# EAGLE design dwm1000_ff3_brd (EAGLE 6.4)
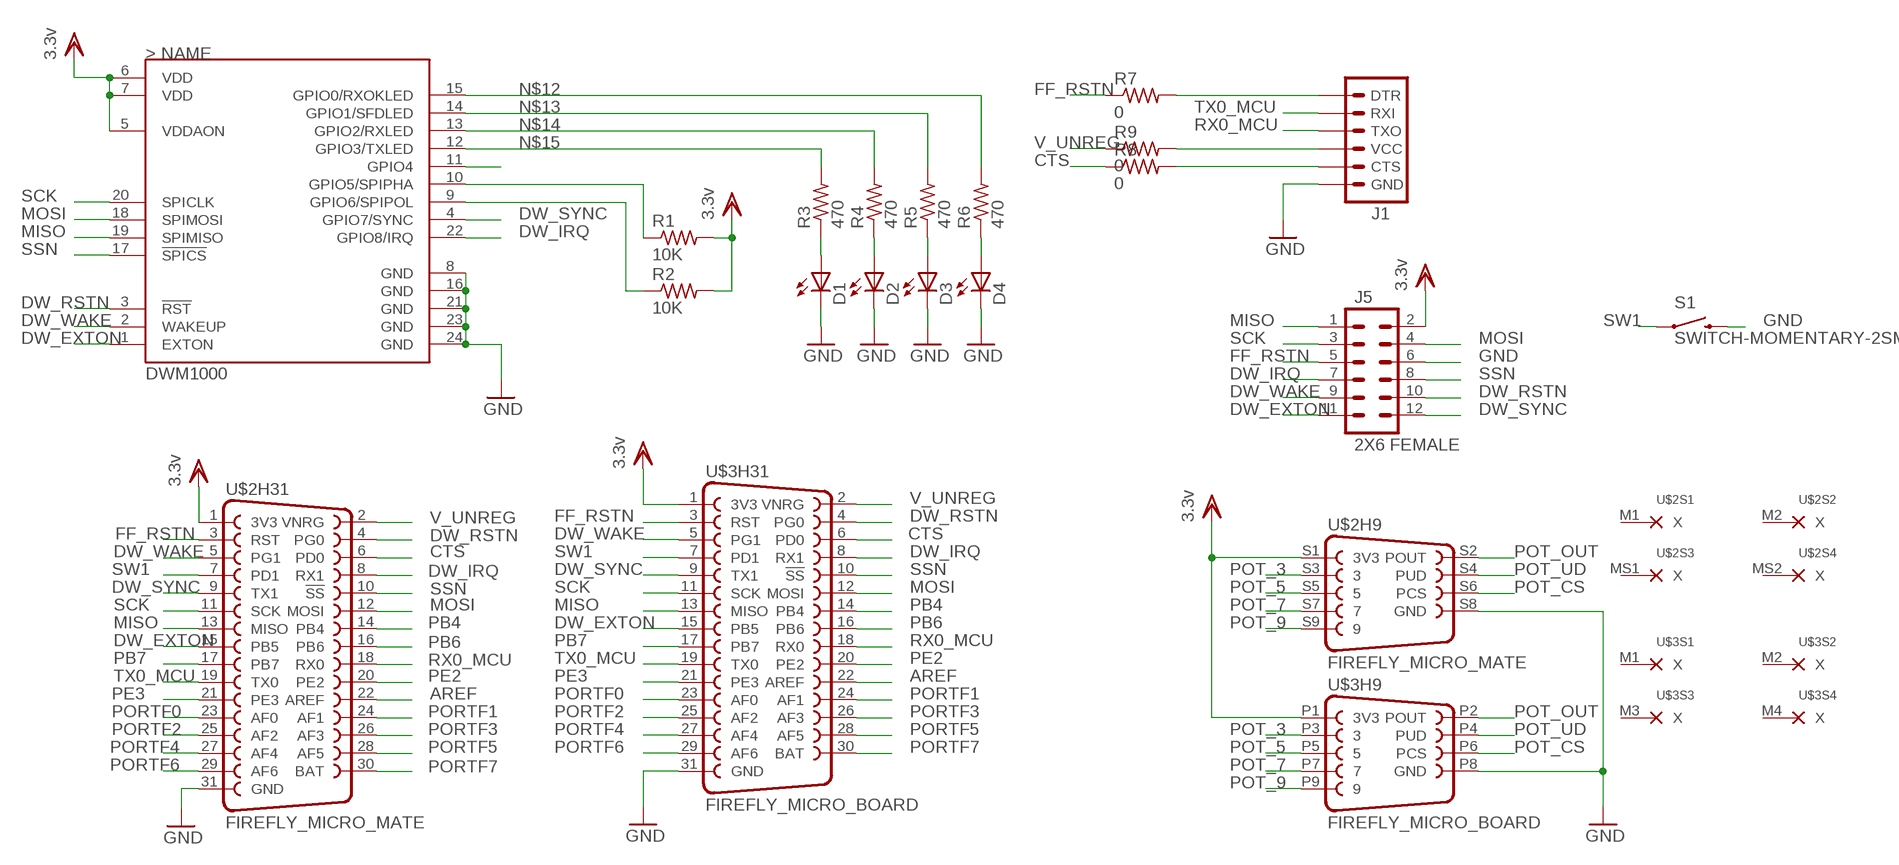
[diagram p0: schematic, sheet 1]

## Parts
D1  LEDCHIP-LED0603  [CHIP-LED0603]
D2  LEDCHIP-LED0603  [CHIP-LED0603]
D3  LEDCHIP-LED0603  [CHIP-LED0603]
D4  LEDCHIP-LED0603  [CHIP-LED0603]
J1  ARDUINO_SERIAL_PROGRAMPTH  [1X06]
J5  2X6 FEMALE  M06X2PTH_FEMALE  [2X6]
R1  10K  R-US_R0603  [R0603]
R2  10K  R-US_R0603  [R0603]
R3  470  R-US_R0603  [R0603]
R4  470  R-US_R0603  [R0603]
R5  470  R-US_R0603  [R0603]
R6  470  R-US_R0603  [R0603]
R7  0  R-US_R0603  [R0603]
R8  0  R-US_R0603  [R0603]
R9  0  R-US_R0603  [R0603]
S1  SWITCH-MOMENTARY-2SMD  [TACTILE-SWITCH-SMD]
U$1  DWM1000  [DWM1000]
U$2  FIREFLY_MICRO_MATE  [FIREFLY_MICRO_MATE]
U$3  FIREFLY_MICRO_BOARD  [FIREFLY_MICRO_BOARD]

## Nets
AREF: U$2.22(H31:AREF) U$3.22(H31:AREF)
CTS: R8.1 U$2.6(H31:PD0) U$3.6(H31:PD0)
DW_EXTON: J5.11 U$1.1(EXTON) U$2.15(H31:PB5) U$3.15(H31:PB5)
DW_IRQ: J5.7 U$1.22(GPIO8/IRQ) U$2.8(H31:RX1) U$3.8(H31:RX1)
DW_RSTN: J5.10 U$1.3(!RST) U$2.4(H31:PG0) U$3.4(H31:PG0)
DW_SYNC: J5.12 U$1.4(GPIO7/SYNC) U$2.9(H31:TX1) U$3.9(H31:TX1)
DW_WAKE: J5.9 U$1.2(WAKEUP) U$2.5(H31:PG1) U$3.5(H31:PG1)
FF_RSTN: J5.5 R7.1 U$2.3(H31:RST) U$3.3(H31:RST)
GND: D1.C D2.C D3.C D4.C J1.6(GND) J5.6 S1.3 U$1.8(GND) U$1.16(GND) U$1.21(GND) U$1.23(GND) U$1.24(GND) U$2.31(H31:GND) U$2.S8(H9:GND) U$3.31(H31:GND) U$3.P8(H9:GND)
MISO: J5.1 U$1.19(SPIMISO) U$2.13(H31:MISO) U$3.13(H31:MISO)
MOSI: J5.4 U$1.18(SPIMOSI) U$2.12(H31:MOSI) U$3.12(H31:MOSI)
N$1: D1.A R3.1
N$2: R1.1 U$1.10(GPIO5/SPIPHA)
N$3: D2.A R4.1
N$4: D3.A R5.1
N$5: D4.A R6.1
N$6: J1.4(VCC) R9.2
N$8: R2.1 U$1.9(GPIO6/SPIPOL)
N$12: R6.2 U$1.15(GPIO0/RXOKLED)
N$13: R5.2 U$1.14(GPIO1/SFDLED)
N$14: R4.2 U$1.13(GPIO2/RXLED)
N$15: R3.2 U$1.12(GPIO3/TXLED)
N$16: U$1.11(GPIO4)
N$18: J1.1(DTR) R7.2
N$19: J1.5(CTS) R8.2
PB4: U$2.14(H31:PB4) U$3.14(H31:PB4)
PB6: U$2.16(H31:PB6) U$3.16(H31:PB6)
PB7: U$2.17(H31:PB7) U$3.17(H31:PB7)
PE2: U$2.20(H31:PE2) U$3.20(H31:PE2)
PE3: U$2.21(H31:PE3) U$3.21(H31:PE3)
PORTF0: U$2.23(H31:AF0) U$3.23(H31:AF0)
PORTF1: U$2.24(H31:AF1) U$3.24(H31:AF1)
PORTF2: U$2.25(H31:AF2) U$3.25(H31:AF2)
PORTF3: U$2.26(H31:AF3) U$3.26(H31:AF3)
PORTF4: U$2.27(H31:AF4) U$3.27(H31:AF4)
PORTF5: U$2.28(H31:AF5) U$3.28(H31:AF5)
PORTF6: U$2.29(H31:AF6) U$3.29(H31:AF6)
PORTF7: U$2.30(H31:BAT) U$3.30(H31:BAT)
POT_3: U$2.S3 U$3.P3
POT_5: U$2.S5 U$3.P5
POT_7: U$2.S7 U$3.P7
POT_9: U$2.S9 U$3.P9
POT_CS: U$2.S6(H9:PCS) U$3.P6(H9:PCS)
POT_OUT: U$2.S2(H9:POUT) U$3.P2(H9:POUT)
POT_UD: U$2.S4(H9:PUD) U$3.P4(H9:PUD)
RX0_MCU: J1.3(TXO) U$2.18(H31:RX0) U$3.18(H31:RX0)
SCK: J5.3 U$1.20(SPICLK) U$2.11(H31:SCK) U$3.11(H31:SCK)
SSN: J5.8 U$1.17(!SPICS) U$2.10(H31:!SS) U$3.10(H31:!SS)
SW1: S1.1 U$2.7(H31:PD1) U$3.7(H31:PD1)
TX0_MCU: J1.2(RXI) U$2.19(H31:TX0) U$3.19(H31:TX0)
V_UNREG: R9.1 U$2.2(H31:VNRG) U$3.2(H31:VNRG)
VDD: J5.2 R1.2 R2.2 U$1.5(VDDAON) U$1.6(VDD) U$1.7(VDD) U$2.1(H31:3V3) U$2.S1(H9:3V3) U$3.1(H31:3V3) U$3.P1(H9:3V3) ; supply symbol labelled 3.3v
Unconnected: U$2.M1(S1:X) U$2.M2(S2:X) U$2.MS1(S3:X) U$2.MS2(S4:X) U$3.M1(S1:X) U$3.M2(S2:X) U$3.M3(S3:X) U$3.M4(S4:X)

## Library data of the parts
D1-D4 = led:LED: LED OSRAM: - CHIPLED LG R971, LG N971, LY N971, LG Q971, LY Q971, LO R971, LY R971 LH N974, LH R974 LS Q976, LO Q976, LY Q976 LO Q996 - Hyper CHIPLED LW Q18S LB Q993, LB Q99A, LB R99A - SideLED LS A670, LO A670, LY A670, LG A670, LP A670 LB A673, LV A673, LT A673, LW A673 LH A674 LY A675 LS A676, LA A676, LO A676, LY A676, LW A676 LS A679, LY A679, LG A679 - Hyper Micro SIDELED® LS Y876, LA Y876, LO Y876, LY Y876 LT Y87S - SmartLED LW L88C, LW L88S LB L89C, LB L89S, LG L890 LS L89K, LO L89K, LY L89K LS L896, LA L896, LO L896, LY L896 - TOPLED LS T670, LO T670, LY T670, LG T670, LP T670 LSG T670, LSP T670, LSY T670, LOP T670, LYG T670 LG T671, LOG T671, LSG T671 LB T673, LV T673, LT T673, LW T673 LH T674 LS T676, LA T676, LO T676, LY T676, LB T676, LH T676, LSB T676, LW T676 LB T67C, LV T67C, LT T67C, LS T67K, LO T67K, LY T67K, LW E67C LS E67B, LA E67B, LO E67B, LY E67B, LB E67C, LV E67C, LT E67C LW T67C LS T679, LY T679, LG T679 LS T770, LO T770, LY T770, LG T770, LP T770 LB T773, LV T773, LT T773, LW T773 LH T774 LS E675, LA E675, LY E675, LS T675 LS T776, LA T776, LO T776, LY T776, LB T776 LHGB T686 LT T68C, LB T68C - Hyper Mini TOPLED® LB M676 - Mini TOPLED Santana® LG M470 LS M47K, LO M47K, LY M47K Source: http://www.osram.convergy.de LUXEON: - LUMILED® LXK2-PW12-R00, LXK2-PW12-S00, LXK2-PW14-U00, LXK2-PW14-V00 LXK2-PM12-R00, LXK2-PM12-S00, LXK2-PM14-U00 LXK2-PE12-Q00, LXK2-PE12-R00, LXK2-PE12-S00, LXK2-PE14-T00, LXK2-PE14-U00 LXK2-PB12-K00, LXK2-PB12-L00, LXK2-PB12-M00, LXK2-PB14-N00, LXK2-PB14-P00, LXK2-PB14-Q00 LXK2-PR12-L00, LXK2-PR12-M00, LXK2-PR14-Q00, LXK2-PR14-R00 LXK2-PD12-Q00, LXK2-PD12-R00, LXK2-PD12-S00 LXK2-PH12-R00, LXK2-PH12-S00 LXK2-PL12-P00, LXK2-PL12-Q00, LXK2-PL12-R00 Source: www.luxeon.com KINGBRIGHT: KA-3528ASYC Source: www.kingbright.com
J1 = SparkFun-Connectors:ARDUINO_SERIAL_PROGRAM: FTDI connector footprints
J5 = SparkFun-Connectors:M06X2; PROD_ID: CONN-12423
R1-R9 = rcl:R-US_: RESISTOR, American symbol
S1 = SparkFun-Electromechanical:SWITCH-MOMENTARY-2: Various NO switches- pushbuttons, reed, etc; PROD_ID: SWCH-08247
U$1 = Decawave:DWM1000: Decawave Module DWM1000 DecaWave module with on-board chip antenna
U$2 = Boards:FIREFLY: Addon Board for Firefly Sensor Nodes This version is compliant with Firefly Micro powered by Atmel Atmega128RFA1. Connectors on female gender match those on Firefly Micro Board. Connectors on male gender mate with Firefly Micro Board. Use these for addons.; GENDER: Male
U$3 = Boards:FIREFLY: Addon Board for Firefly Sensor Nodes This version is compliant with Firefly Micro powered by Atmel Atmega128RFA1. Connectors on female gender match those on Firefly Micro Board. Connectors on male gender mate with Firefly Micro Board. Use these for addons.; GENDER: Female

## Board
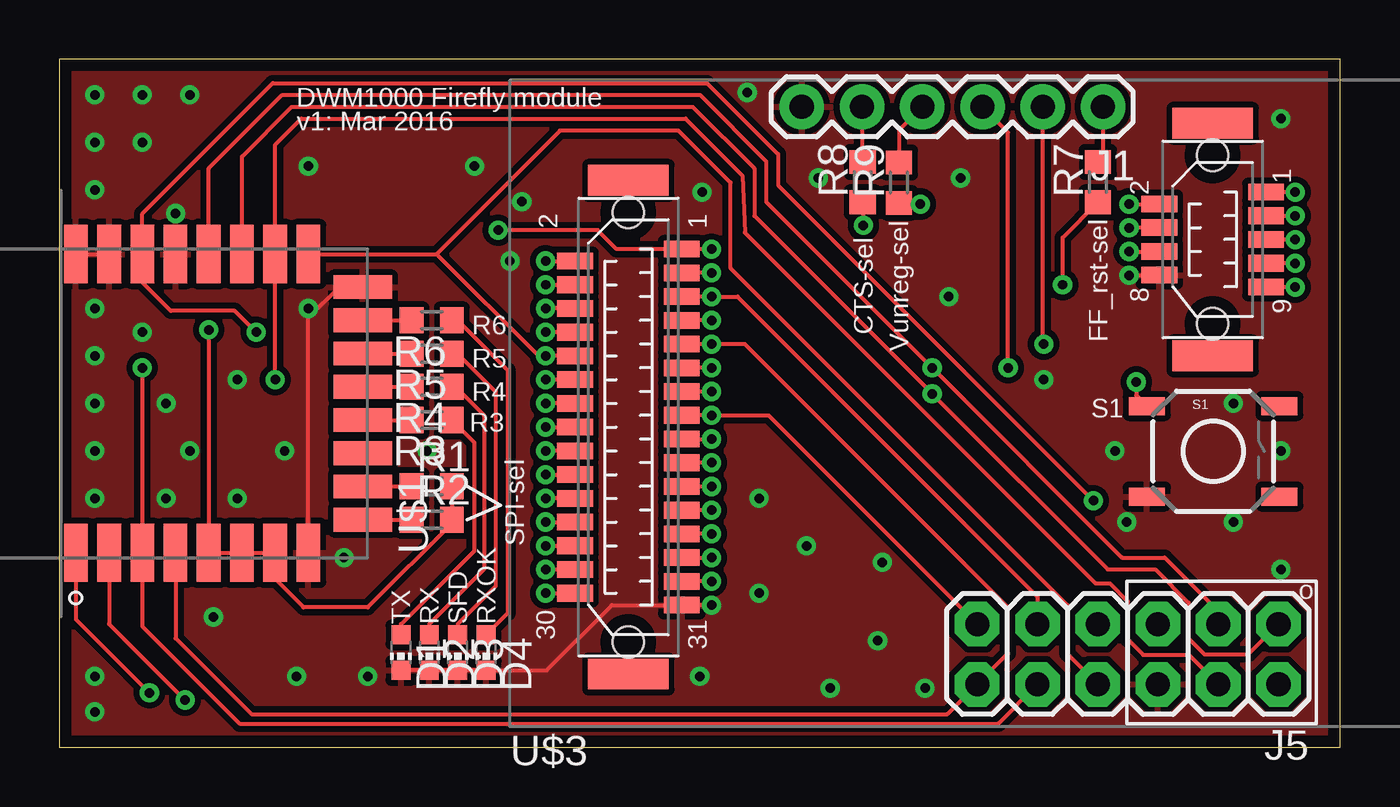
[diagram p1: board, top side]
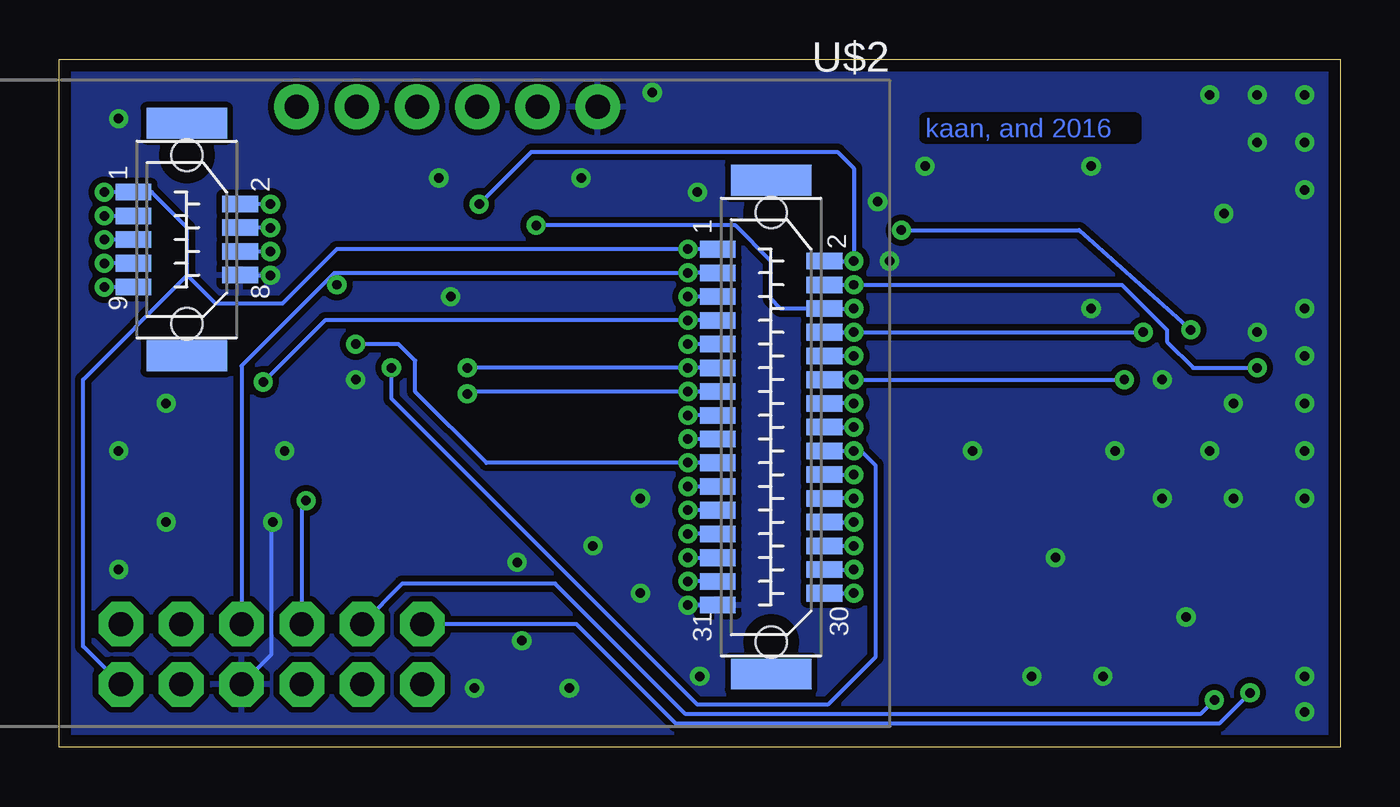
[diagram p2: board, bottom side, seen from below]

Size 54 x 29 mm. Coordinates in mm from the lower left corner, seen from the top.
Outline: 0,0 54,0 54,29 0,29 0,0
Copper layers (1*16): Top 0.035mm / dielectric 1.5mm / Bottom 0.035mm
Design rules "default *": minimum track width 7mil, minimum drill 0.4mm, track to track 7mil, track to pad 7mil, pad to pad 7mil, via to via 7mil, smd to smd 7mil, copper to edge 20mil, drill to drill 7mil, minimum pad ring 10mil, minimum via ring 8mil, stop-mask expansion 4mil, vias tented up to drill 0mil, thermal gap 10mil

### Footprints (pad centres in the part's own frame; a part is rotated, then mirrored left to right if it is on the bottom)
CHIP-LED0603 = smd 0.8 x 0.8: A 0,-0.75; C 0,0.75
1X06 = drill 1.016 pad 1.88: 1 0,0; 2 2.54,0; 3 5.08,0; 4 7.62,0; 5 10.16,0; 6 12.7,0
2X6 = drill 1.016 pad 1.88 octagon: 1 0,0; 2 0,2.54; 3 2.54,0; 4 2.54,2.54; 5 5.08,0; 6 5.08,2.54; 7 7.62,0; 8 7.62,2.54; 9 10.16,0; 10 10.16,2.54; 11 12.7,0; 12 12.7,2.54
R0603 = smd 1 x 1.1: 1 -0.85,0; 2 0.85,0
TACTILE-SWITCH-SMD = smd 1.524 x 0.762: 1 -2.794,1.905; 2 2.794,1.905; 3 -2.794,-1.905; 4 2.794,-1.905
DWM1000 = smd 2.45 x 1: 1 -6.295,12.3; 2 -6.295,10.9; 3 -6.295,9.5; 4 -6.295,8.1; 5 -6.295,6.7; 6 -6.295,5.3; 7 -6.295,3.9; 8 -6.292,2.5; 17 6.295,2.5; 18 6.295,3.9; 19 6.295,5.3; 20 6.295,6.7; 21 6.295,8.1; 22 6.295,9.5; 23 6.295,10.9; 24 6.295,12.3 | smd 1 x 2.45: 9 -4.9,0.205; 10 -3.5,0.205; 11 -2.1,0.205; 12 -0.7,0.205; 13 0.7,0.205; 14 2.1,0.205; 15 3.5,0.205; 16 4.9,0.205
FIREFLY_MICRO_MATE = smd 1.5 x 0.7: 1 -13.758,-6.497; 2 -18.258,-5.997; 3 -13.758,-5.497; 4 -18.258,-4.997; 5 -13.758,-4.497; 6 -18.258,-3.997; 7 -13.758,-3.497; 8 -18.258,-2.997; 9 -13.758,-2.497; 10 -18.258,-1.997; 11 -13.758,-1.497; 12 -18.258,-0.997; 13 -13.758,-0.497; 14 -18.258,0.003; 15 -13.758,0.503; 16 -18.258,1.003; 17 -13.758,1.503; 18 -18.258,2.003; 19 -13.758,2.503; 20 -18.258,3.003; 21 -13.758,3.503; 22 -18.258,4.003; 23 -13.758,4.503; 24 -18.258,5.003; 25 -13.758,5.503; 26 -18.258,6.003; 27 -13.758,6.503; 28 -18.258,7.003; 29 -13.758,7.503; 30 -18.258,8.003; 31 -13.758,8.503; S1 10.874,-8.905; S2 6.374,-8.405; S3 10.874,-7.905; S4 6.374,-7.405; S5 10.874,-6.905; S6 6.374,-6.405; S7 10.874,-5.905; S8 6.374,-5.405; S9 10.874,-4.905 | smd 3.4 x 1.3: M1 -16.008,-9.397; M2 -16.008,11.403; MS1 8.624,-11.805; MS2 8.624,-2.005 | hole 1.321: -16.008,-8.047; -16.008,10.053; 8.624,-10.455; 8.624,-3.355
FIREFLY_MICRO_BOARD = smd 1.5 x 0.7: 1 -13.758,6.499; 2 -18.258,5.999; 3 -13.758,5.499; 4 -18.258,4.999; 5 -13.758,4.499; 6 -18.258,3.999; 7 -13.758,3.499; 8 -18.258,2.999; 9 -13.758,2.499; 10 -18.258,1.999; 11 -13.758,1.499; 12 -18.258,0.999; 13 -13.758,0.499; 14 -18.258,-0.001; 15 -13.758,-0.501; 16 -18.258,-1.001; 17 -13.758,-1.501; 18 -18.258,-2.001; 19 -13.758,-2.501; 20 -18.258,-3.001; 21 -13.758,-3.501; 22 -18.258,-4.001; 23 -13.758,-4.501; 24 -18.258,-5.001; 25 -13.758,-5.501; 26 -18.258,-6.001; 27 -13.758,-6.501; 28 -18.258,-7.001; 29 -13.758,-7.501; 30 -18.258,-8.001; 31 -13.758,-8.501; P1 10.874,8.907; P2 6.374,8.407; P3 10.874,7.907; P4 6.374,7.407; P5 10.874,6.907; P6 6.374,6.407; P7 10.874,5.907; P8 6.374,5.407; P9 10.874,4.907 | smd 3.4 x 1.3: M1 8.624,11.807; M2 8.624,2.007; M3 -16.008,-11.401; M4 -16.008,9.399 | hole 1.321: -16.008,-10.051; -16.008,8.049; 8.624,3.357; 8.624,10.457

### Placement (x,y rotation side)
D1  14.4,4 180 top
D2  15.6,4 180 top
D3  16.8,4 180 top
D4  18,4 180 top
J1  44,27 180 top
J5  51.4,5.2 180 top
R1  15.7,11 0 top
R2  15.7,9.6 0 top
R3  15.7,13.8 180 top
R4  15.7,15.2 180 top
R5  15.7,16.6 180 top
R6  15.7,18 180 top
R7  43.78,23.82 90 top
R8  33.87,23.82 90 top
R9  35.4,23.8 90 top
S1  48.65,12.48 0 top
U$1  13,14.5 90 top
U$2  40,14.5 180 bottom
U$3  40,14.5 0 top

### Tracks (layer width: path | path; a pad name or v marks a point on that pad's centre or on a via)
AREF  (via drill 0.4)
  Top 0.178: U$3.22 v20.5,10.5
  Bottom 0.178: v20.5,10.5 U$3.22
CTS  (via drill 0.4)
  Top 0.178: U$3.6 v20.5,18.5 | v33.9,22 33.9,22.94 R8.1
  Bottom 0.178: v20.5,18.5 U$3.6 23.6,18.5 24,18.9 24,20.5 25.5,22 v33.9,22
DW_EXTON  (via drill 0.4)
  Top 0.178: v27.5,14 U$3.15 | U$1.1 0.7,5.4 v3.8,2.3 | v27.5,14 29.9,14 J5.11
  Bottom 0.178: U$3.15 v27.5,14 | v3.8,2.3 5.1,1 28,1 32.2,5.2 J5.11
DW_IRQ  (via drill 0.4)
  Top 0.178: U$3.8 v20.5,17.5 | v43.6,10.4 30.3,23.7 30.3,25 27.3,28 9,28 3.5,22.5 U$1.22 3.5,19.6 4.7,18.4 7.4,18.4 v8.3,17.5
  Bottom 0.178: U$3.8 v20.5,17.5 v8.3,17.5 | v43.6,10.4 43.78,10.22 J5.7
DW_RSTN  (via drill 0.4)
  Top 0.178: v20.5,19.5 U$3.4 | J5.10 39.58,1 7.6,1 3.5,5.1 U$1.3 v3.5,16
  Bottom 0.178: U$3.4 v20.5,19.5 | v20.5,19.5 | v20.5,19.5 9.2,19.5 7.3,17.6 7.3,17.1 6.2,16 v3.5,16
DW_SYNC  (via drill 0.4)
  Top 0.178: U$3.9 v27.5,17 28.9,17 40,5.9 40,3.96 J5.12 37.44,1.4 8.1,1.4 4.9,4.6 U$1.4
  Bottom 0.178: U$3.9 v27.5,17
DW_WAKE  (via drill 0.4)
  Top 0.178: U$3.5 v27.5,19 28.6,19 41.24,6.36 J5.9 | U$1.2 2.1,5.2 v5.3,2
  Bottom 0.178: U$3.5 v27.5,19 | J5.9 39.54,6.9 33.1,6.9 27.6,1.4 5.9,1.4 v5.3,2
FF_RSTN  (via drill 0.4)
  Top 0.178: v27.5,20 U$3.3 | v42.3,19.5 42.3,21.49 R7.1
  Bottom 0.178: U$3.3 v27.5,20 42.4,20 | 42.4,20 46.32,16.08 J5.5 | 42.4,20 42.4,19.6 v42.3,19.5
GND  (via drill 0.4)
  Top 0.178: v27.5,6 U$3.31 23.3,6 20.55,3.25 D4.C D3.C D2.C D1.C | v45.1,19.9 U$2.S8 U$3.P8 | U$1.24 U$1.23 | U$1.8 10.5,18.1 11.8,19.4 U$1.16
  Bottom 0.178: U$3.31 v27.5,6 | U$3.P8 v45.1,19.91 v45.1,19.9 | J5.6 45.05,3.93 45.05,9.45 v45,9.5
  other vias: 1.5,27.5 3.5,27.5 5.5,27.5 1.5,25.5 3.5,25.5 1.5,23.5 4.9,22.5 10.5,24.5 17.5,24.5 19.5,23 19,20.5 15.5,12.5 12,8 6.5,5.5 10,3 13,3 1.5,18.5 1.5,16.5 1.5,14.5 1.5,12.5 1.5,10.5 4.5,14.5 5.5,12.5 4.5,10.5 7.5,15.5 7.5,10.5 9.5,12.5 1.5,3 1.5,1.5 29,27.6 27.1,23.4 32,24 38,24 29.5,10.5 31.5,8.5 29.5,6.5 27,3 32.5,2.5 34.5,4.5 36.5,2.5 34.7,7.8 49.5,9.5 51.5,7.5 44.5,12.5 49.5,14.5 51.5,12.5 41.5,15.5 37.5,19 51.5,26.5 3.5,17.5 10.5,18.5
  pour Top (isolate 0.254): 0,29 54,29 54,0 0,0
  pour Bottom (isolate 0.254): 0,29 54,29 54,0 0,0
MISO  (via drill 0.4)
  Top 0.178: v27.5,15 U$3.13 | U$1.19 7.7,24.9 9.8,27 26.7,27 29.3,24.4 29.3,22.4 v36.8,14.9 36.85,14.85 44.2,7.5 46.2,7.5 47.6,6.1 47.6,4.6 48.27,3.92 50.12,3.92 J5.1
  Bottom 0.178: U$3.13 v27.5,15 36.7,15 v36.8,14.9
MOSI  (via drill 0.4)
  Top 0.178: J5.4 47.62,3.9 45.7,3.9 45.05,4.55 45.05,6.15 44.3,6.9 43.7,6.9 28.9,21.7 28.8,24.1 26.4,26.5 10.2,26.5 9.1,25.4 U$1.18 v9.1,15.5 | U$3.12 v20.5,15.5
  Bottom 0.178: U$3.12 v20.5,15.5 v9.1,15.5
N$1
  Top 0.178: R3.1 17.5,12.85 17.5,8.3 14.4,5.2 D1.A
N$2
  Top 0.178: U$1.10 R1.1
N$3
  Top 0.178: D2.A 15.6,5.2 17.9,7.5 17.9,14 16.7,15.2 R4.1
N$4
  Top 0.178: D3.A 16.8,5.2 18.4,6.8 18.4,15 16.8,16.6 R5.1
N$5
  Top 0.178: D4.A 18.9,5.65 18.9,15.9 16.8,18 R6.1
N$6
  Top 0.178: J1.4 35.4,26.02 R9.2
N$8
  Top 0.178: U$1.9 R2.1
N$12
  Top 0.178: U$1.15 R6.2
N$13
  Top 0.178: U$1.14 R5.2
N$14
  Top 0.178: U$1.13 R4.2
N$15
  Top 0.178: U$1.12 R3.2
N$18
  Top 0.178: J1.1 44,24.89 R7.2
N$19
  Top 0.178: J1.5 33.84,24.7 R8.2
PB4  (via drill 0.4)
  Top 0.178: U$3.14 v20.5,14.5
  Bottom 0.178: v20.5,14.5 U$3.14
PB6  (via drill 0.4)
  Top 0.178: v20.5,13.5 U$3.16
  Bottom 0.178: U$3.16 v20.5,13.5
PB7  (via drill 0.4)
  Top 0.178: U$3.17 v27.5,13
  Bottom 0.178: v27.5,13 U$3.17
PE2  (via drill 0.4)
  Top 0.178: v20.5,11.5 U$3.20
  Bottom 0.178: U$3.20 v20.5,11.5
PE3  (via drill 0.4)
  Top 0.178: U$3.21 v27.5,11
  Bottom 0.178: v27.5,11 U$3.21
PORTF0  (via drill 0.4)
  Top 0.178: v27.5,10 U$3.23
  Bottom 0.178: U$3.23 v27.5,10
PORTF1  (via drill 0.4)
  Top 0.178: v20.5,9.5 U$3.24
  Bottom 0.178: U$3.24 v20.5,9.5
PORTF2  (via drill 0.4)
  Top 0.178: v27.5,9 U$3.25
  Bottom 0.178: U$3.25 v27.5,9
PORTF3  (via drill 0.4)
  Top 0.178: v20.5,8.5 U$3.26
  Bottom 0.178: U$3.26 v20.5,8.5
PORTF4  (via drill 0.4)
  Top 0.178: U$3.27 v27.5,8
  Bottom 0.178: v27.5,8 U$3.27
PORTF5  (via drill 0.4)
  Top 0.178: v20.5,7.5 U$3.28
  Bottom 0.178: U$3.28 v20.5,7.5
PORTF6  (via drill 0.4)
  Top 0.178: v27.5,7 U$3.29
  Bottom 0.178: U$3.29 v27.5,7
PORTF7  (via drill 0.4)
  Top 0.178: v20.5,6.5 U$3.30
  Bottom 0.178: U$3.30 v20.5,6.5
POT_3  (via drill 0.4)
  Top 0.178: U$3.P3 v52.1,22.41 v52.1,22.4
  Bottom 0.178: v52.1,22.4 U$2.S3 U$3.P3
POT_5  (via drill 0.4)
  Top 0.178: v52.1,21.4 U$2.S5 U$3.P5
  Bottom 0.178: U$3.P5 v52.1,21.41 v52.1,21.4
POT_7  (via drill 0.4)
  Top 0.178: v52.1,20.4 U$2.S7 U$3.P7
  Bottom 0.178: U$3.P7 v52.1,20.41 v52.1,20.4
POT_9  (via drill 0.4)
  Top 0.178: v52.1,19.4 U$2.S9 U$3.P9
  Bottom 0.178: U$3.P9 v52.1,19.41 v52.1,19.4
POT_CS  (via drill 0.4)
  Top 0.178: v45.1,20.9 U$2.S6 U$3.P6
  Bottom 0.178: U$3.P6 v45.1,20.91 v45.1,20.9
POT_OUT  (via drill 0.4)
  Top 0.178: v45.1,22.9 U$2.S2 U$3.P2
  Bottom 0.178: U$2.S2 U$3.P2 v45.1,22.91 v45.1,22.9
POT_UD  (via drill 0.4)
  Top 0.178: U$3.P4 v45.1,21.91 v45.1,21.9
  Bottom 0.178: v45.1,21.9 U$2.S4 U$3.P4
RX0_MCU  (via drill 0.4)
  Top 0.178: U$3.18 v20.5,12.5 | v40,16 40,25.92 J1.3
  Bottom 0.178: U$3.18 v20.5,12.5 20.2,12.5 19.6,11.9 19.6,3.8 21.6,1.8 27.1,1.8 40,14.7 v40,16
SCK  (via drill 0.4)
  Top 0.178: v27.5,16 U$3.11 | U$1.20 6.3,24.4 9.4,27.5 27,27.5 29.8,24.7 29.8,23 36.65,16.15 v36.8,16 44.8,8 46.6,8 48.86,5.74 J5.3
  Bottom 0.178: U$3.11 v27.5,16 | v27.5,16 | v27.5,16 v36.8,16
SSN  (via drill 0.4)
  Top 0.178: 15.9,20.8 20.2,16.5 v20.5,16.5 U$3.10 | J5.8 42.5,3.94 42.5,6 28.3,20.2 28.3,23.8 26.1,26 21.11,26 15.9,20.8 | U$1.17 15.9,20.8
  Bottom 0.178: U$3.10 v20.5,16.5
SW1  (via drill 0.4)
  Top 0.178: v27.5,18 U$3.7 | v45.4,15.4 45.4,14.83 S1.1
  Bottom 0.178: U$3.7 v27.5,18 | v27.5,18 | v27.5,18 42.8,18 v45.4,15.4
TX0_MCU  (via drill 0.4)
  Top 0.178: v27.5,12 U$3.19 | v41.5,17 41.46,17.04 J1.2
  Bottom 0.178: U$3.19 v27.5,12 | v27.5,12 | v27.5,12 36,12 39,15 39,16.3 39.7,17 v41.5,17
V_UNREG  (via drill 0.4)
  Top 0.178: v20.5,20.5 U$3.2 | R9.1 35.45,22.9 v36.3,22.9
  Bottom 0.178: U$3.2 v20.5,20.5 20.5,24.4 21.2,25.1 34.1,25.1 v36.3,22.9
VDD  (via drill 0.4)
  Top 0.178: v27.5,21 U$3.1 23.5,21 22.7,21.8 v18.5,21.8 | v52.1,23.4 U$2.S1 U$3.P1 U$2.S1 | R1.2 R2.2 16.55,9.45 13,5.9 10.3,5.9 9.1,7.1 U$1.7 U$1.6 U$1.5 v6.3,17.6
  Bottom 0.178: U$3.1 v27.5,21 | v27.5,21 | U$3.P1 v52.1,23.41 v52.1,23.4 v52.09,23.41 U$3.P1 U$2.S1 50.1,23.4 48.6,21.9 48.6,19.9 | v27.5,21 42.3,21 44.6,18.7 47.4,18.7 48.6,19.9 | J5.2 53,4.26 53,15.5 48.6,19.9 | v18.5,21.8 11,21.8 v6.3,17.6

### Text on the board
Bottom: kaan, and 2016
tPlace: DWM1000 Firefly module | v1: Mar 2016 | R6 | CTS-sel | Vunreg-sel | FF_rst-sel | R5 | R4 | S1 | R3 | SPI-sel | o | TX | RX | SFD | RXOK
tSilk: DWM1000 Header V1.0 | kaan